# Altium schematic sheet IRF530N_MOS_Amplifier.SchDoc: IRF530N_MOS_Amplifier
size A4
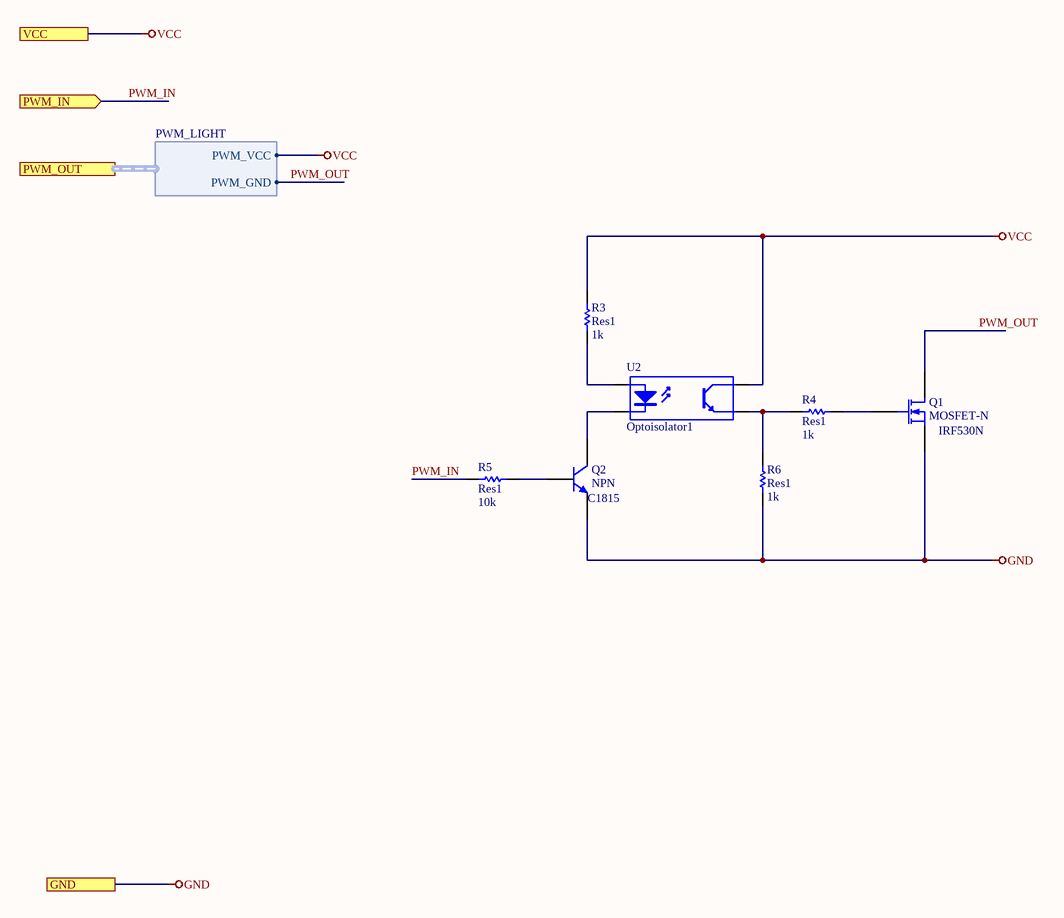
[diagram p0: IRF530N_MOS_Amplifier.SchDoc]

## Parts
Q1  MOSFET-N  name: IRF530N  [TO-263]
Q2  NPN  name: C1815  [SOT-23]
R3  Res1  value 1k  [R0805]
R4  Res1  value 1k  [R0805]
R5  Res1  value 10k  [R0805]
R6  Res1  value 1k  [R0805]
U2  Optoisolator1  [DIP_4]

## Ports
GND, PWM_IN (in), PWM_OUT (harness PWM_LIGHT), VCC

## Harnesses
PWM_LIGHT: PWM_VCC, PWM_GND

## Nets
GND: Q1.3(S) Q2.3(E) R6.1 ; port GND
VCC: R3.2 U2.4(C) ; port VCC, port PWM_OUT.PWM_VCC
PWM_IN: R5.1 ; port PWM_IN
PWM_OUT: Q1.2(D) ; port PWM_OUT.PWM_GND
NetQ1_1: Q1.1(G) R4.1
NetQ2_1: Q2.1(C) U2.2(K)
NetQ2_2: Q2.2(B) R5.2
NetR3_1: R3.1 U2.1(A)
NetR4_2: R4.2 R6.2 U2.3(E)

## Library data of the parts
Q1 = MOSFET-N: N-Channel MOSFET; Published: 8-Jun-2000; LatestRevisionDate: 17-Jul-2002; LatestRevisionNote: Re-released for DXP Platform.; PackageVersion: 1995/1996; PackageReference: E3; Publisher: Altium Limited; PackageDescription: TO, Flat Index; 3 In-Line, Axial Leads; Body Dia. 4.6mm; Lead Dia. 0.5 mm (max)
Q2 = NPN: NPN Bipolar Transistor; pin to pad: 1>3 2>1 3>2; PackageReference: TO-226-AA; PackageDescription: TO, Flat Index; 3 In-Line, Axial Leads; Body Dia. 4.8mm; Leads 0.55 x 0.51 mm (max); Code_JEDEC: TO-226-AA; Published: 8-Jun-2000; LatestRevisionDate: 17-Jul-2002; LatestRevisionNote: Re-released for DXP Platform.; Publisher: Altium Limited
R3-R6 = Res1: Resistor
U2 = Optoisolator1: 4-Pin Phototransistor Optocoupler; Published: 24-Mar-1999; LatestRevisionDate: 04-Mar-2005; LatestRevisionNote: Sch pins 3 & 4 Swapped.; DatasheetVersion: Nov-2003; PackageReference: DIP-4; Publisher: Altium Limited